# Altium schematic sheet MCU.SchDoc
size Legal; CompanyName: PloopyCo; Organization: Ploopy Co; Address1: 137-1140 Burnhamthorpe Road W; Address2: Mississauga; Address3: Ontario; Address4: Canada L5C 0A3; DocumentNumber: 3; Revision: R1.004; SheetNumber: 3; SheetTotal: 8
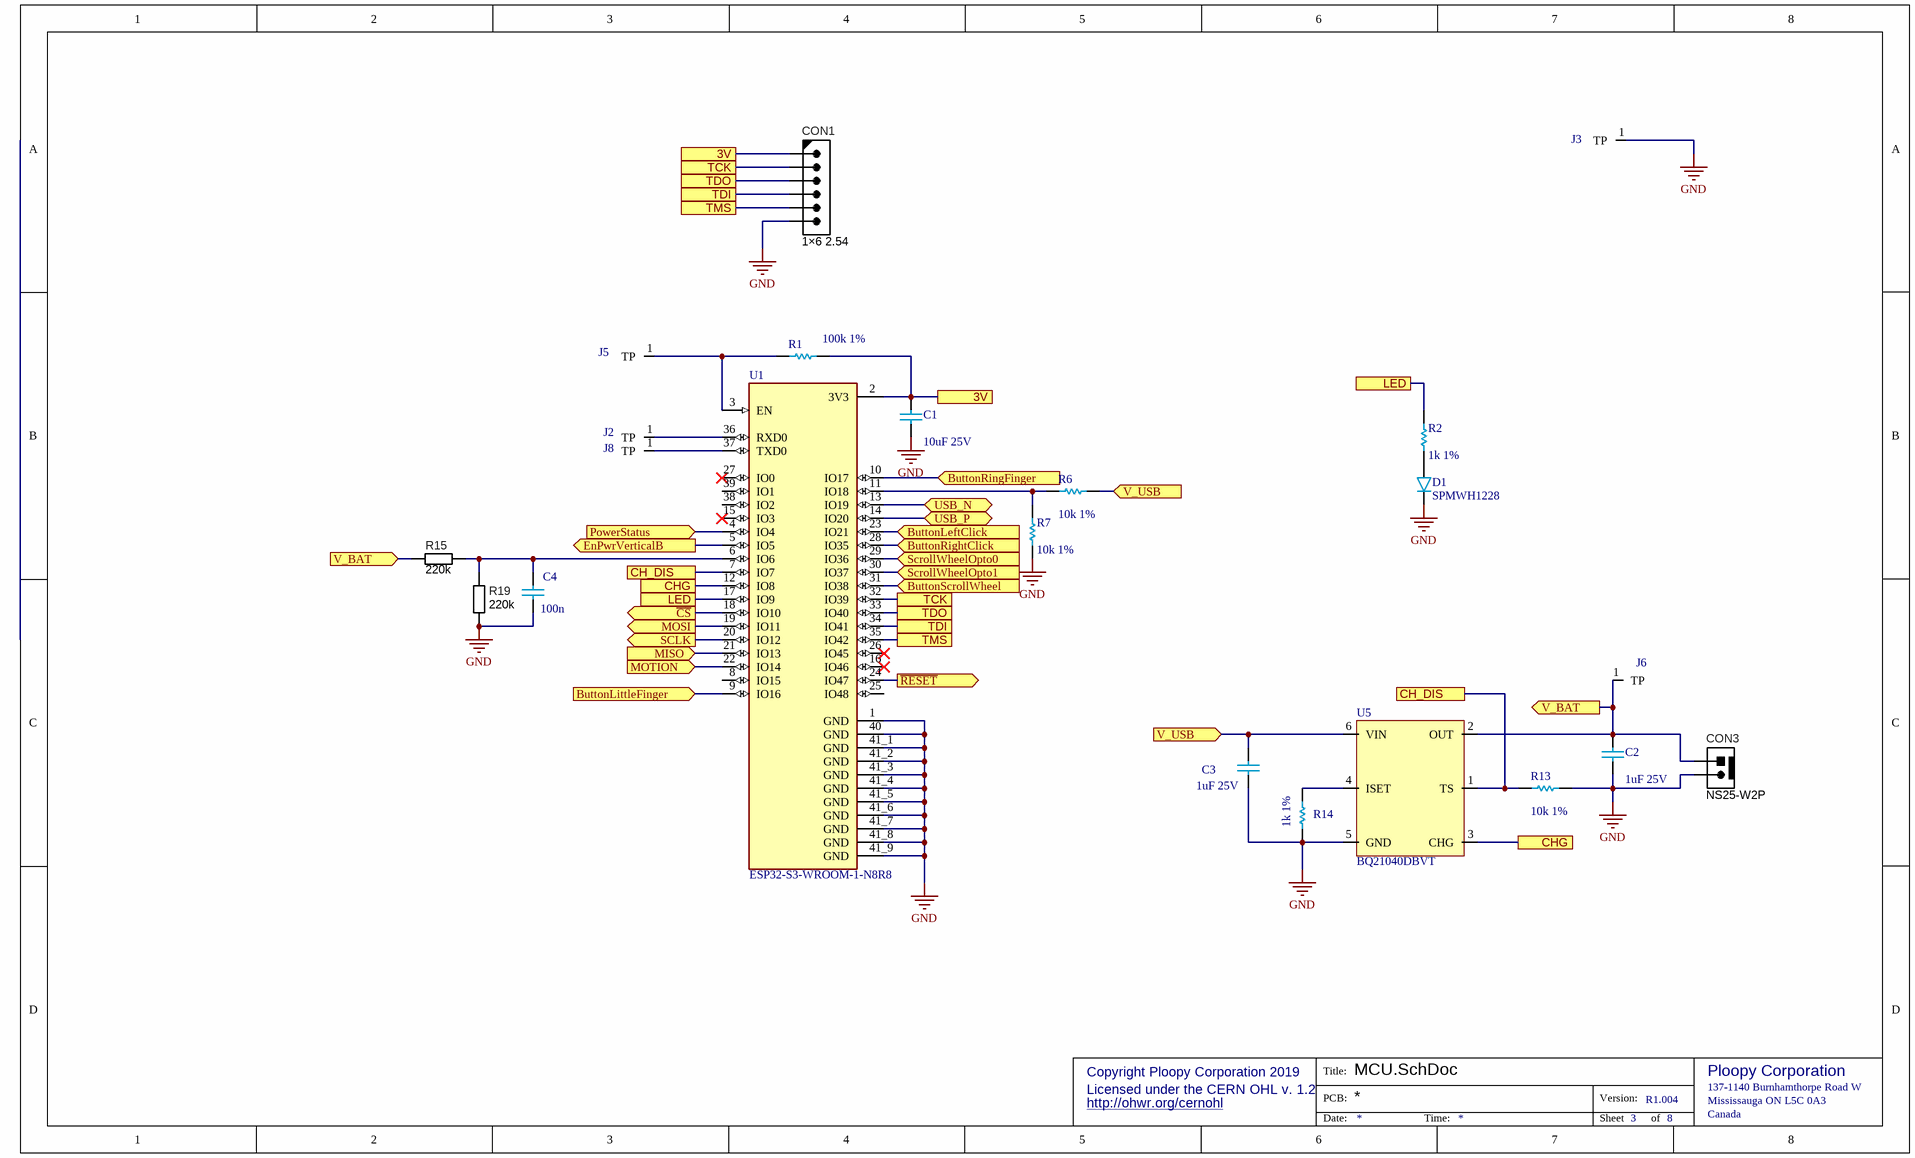
[diagram p0: MCU.SchDoc]

## Parts
C1  value 10uF 25V  [C0603]  (hidden comment: 0805)
C2  value 1uF 25V  [C0603]  (hidden comment: 0805)
C3  value 1uF 25V  [C0603]  (hidden comment: 0805)
C4  value 100n  [C0603]  (hidden comment: 0805)
CON1  1×6 2.54  [PH2.54_1X6]
CON3  NS25-W2P  [MOLEST_L2.54_2W]
D1  SPMWH1228  [SPMWH1228]
J2  TestPoint  [TestPoint]  (value not drawn)
J3  TestPoint  [TestPoint]  (value not drawn)
J5  TestPoint  [TestPoint]  (value not drawn)
J6  TestPoint  [TestPoint]  (value not drawn)
J8  TestPoint  [TestPoint]  (value not drawn)
R1  value 100k 1%  [R0603]  (hidden comment: 0805)
R2  value 1k 1%  [R0603]  (hidden comment: 0805)
R6  value 10k 1%  [R0603]  (hidden comment: 0805)
R7  value 10k 1%  [R0603]  (hidden comment: 0805)
R13  value 10k 1%  [R0603]  (hidden comment: 0805)
R14  value 1k 1%  [R0603]  (hidden comment: 0805)
R15  220k  [R0603]
R19  220k  [R0603]
U1  ESP32-S3-WROOM-1-N8R8  [XCVR_ESP32S3WROOM1N8R8]
U5  BQ21040DBVT  [PESD3V3S4UD - SOT95P275X110-6N]

## Ports
3V, ButtonLeftClick (in), ButtonLittleFinger (in), ButtonRightClick (in), ButtonRingFinger (in), ButtonScrollWheel (in), CH_DIS, CHG, EnPwrVerticalB (out), LED, MISO (in), MOSI (out), MOTION (in), PowerStatus (in), SCLK (out), ScrollWheelOpto0 (in), ScrollWheelOpto1 (in), TCK, TDI, TDO, TMS, USB_N (bidir), USB_P (bidir), V_BAT (in), V_BAT (out), V_USB (in), ~{CS} (out), ~{RESET} (out)

## Nets
GND: C1.1 C2.1 C3.1 C4.1 CON1.6 CON3.2 D1.2(C) J3.1(TP) R7.1 R13.1 R14.1 R19.1 U1.1(GND) U1.40(GND) U1.41_1(GND) U1.41_2(GND) U1.41_3(GND) U1.41_4(GND) U1.41_5(GND) U1.41_6(GND) U1.41_7(GND) U1.41_8(GND) U1.41_9(GND) U5.5(GND)
3V: C1.2 CON1.1 R1.2 U1.2(3V3) ; port 3V
ButtonLeftClick: U1.23(IO21) ; port ButtonLeftClick
ButtonLittleFinger: U1.9(IO16) ; port ButtonLittleFinger
ButtonRightClick: U1.28(IO35) ; port ButtonRightClick
ButtonRingFinger: U1.10(IO17) ; port ButtonRingFinger
ButtonScrollWheel: U1.31(IO38) ; port ButtonScrollWheel
~{CS}: U1.18(IO10) ; port ~{CS}
CH_DIS: R13.2 U1.7(IO7) U5.1(TS) ; port CH_DIS
CHG: U1.12(IO8) U5.3(CHG) ; port CHG
EnPwrVerticalB: U1.5(IO5) ; port EnPwrVerticalB
LED: R2.2 U1.17(IO9) ; port LED
MISO: U1.21(IO13) ; port MISO
MOSI: U1.19(IO11) ; port MOSI
MOTION: U1.22(IO14) ; port MOTION
PowerStatus: U1.4(IO4) ; port PowerStatus
~{RESET}: U1.24(IO47) ; port ~{RESET}
SCLK: U1.20(IO12) ; port SCLK
ScrollWheelOpto0: U1.29(IO36) ; port ScrollWheelOpto0
ScrollWheelOpto1: U1.30(IO37) ; port ScrollWheelOpto1
TCK: CON1.2 U1.32(IO39) ; port TCK
TDI: CON1.4 U1.34(IO41) ; port TDI
TDO: CON1.3 U1.33(IO40) ; port TDO
TMS: CON1.5 U1.35(IO42) ; port TMS
USB_N: U1.13(IO19) ; port USB_N
USB_P: U1.14(IO20) ; port USB_P
V_BAT: C2.2 CON3.1 J6.1(TP) R15.1 U5.2(OUT) ; port V_BAT
V_USB: C3.2 R6.2 U5.6(VIN) ; port V_USB
NetC4_2: C4.2 R15.2 R19.2 U1.6(IO6)
NetD1_1: D1.1(A) R2.1
NetJ2_1: J2.1(TP) U1.36(RXD0)
NetJ5_1: J5.1(TP) R1.1 U1.3(EN)
NetJ8_1: J8.1(TP) U1.37(TXD0)
NetR6_1: R6.1 R7.2 U1.11(IO18)
NetR14_2: R14.2 U5.4(ISET)

Not connected (* = marked no-connect by the designer): U1 8(IO15) 15(IO3)* 16(IO46)* 25(IO48) 26(IO45)* 27(IO0)* 38(IO2) 39(IO1)

## Notes on the sheet
- Copyright Ploopy Corporation 2019
- Licensed under the CERN OHL v. 1.2
- http://ohwr.org/cernohl
- Title:
- PCB:
- Version:
- Ploopy Corporation
- Mississauga ON L5C 0A3
- 137-1140 Burnhamthorpe Road W
- Date:
- Time:
- Sheet
- of
- Canada

## Library data of the parts
C1 = Cap 10uF 25V: 0805, X5R or better; PNP-Nzl: 2; PNP-dx: 0; PNP-X: 2.00; PNP-Y: 1.25; PNP-Lv: 1; PNP-TS: 70; PNP-Type: chi; PNP-FeedType: Tape; PNP-TapeWidth: 8; PNP-dy: 0; PNP-Pt: 0; PNP-W: 0; PNP-Thk: 1.25; PNP-Level: 1; PNP-Voff: 0; PNP-PlacePriority: 1; PNP-A: 0; PNP-TapeIndex: 1; Supplier 1: Mouser; Supplier Part Number 1: 81-GRM21BR61E106KA3L; Supplier 2: Digi-Key; Supplier Part Number 2: 490-5523-1-ND; PNP-da: 0
C2-C4 = Cap 1uF 25V: 0805, X5R or better; PNP-Nzl: 2; PNP-dx: 0; PNP-X: 2.00; PNP-Y: 1.25; PNP-Lv: 1; PNP-TS: 70; PNP-Type: chi; PNP-FeedType: Tape; PNP-TapeWidth: 8; Supplier 1: Digi-Key; Supplier Part Number 1: 1276-1066-2-ND; Supplier 2: Digi-Key; Supplier Part Number 2: 1276-1066-1-ND; PNP-dy: 0; PNP-Pt: 0; PNP-W: 0; PNP-Thk: 1.25; PNP-Level: 1; PNP-Voff: 0; PNP-PlacePriority: 1; PNP-A: 0; PNP-TapeIndex: 1; PNP-da: 0
CON1 = PH2.54_1X6: 1x3 standart 100mil pinheader
CON3 = MOLEST_L2.54_2W: Molex-like 2.54mm connector with lock
D1 = SPMWH1228: 3V/0.5W white LED, 2.8mm x 3.5mm; PNP-Nzl: 3; PNP-dx: 0; PNP-X: 2.8; PNP-Y: 3.2; PNP-A: 90; PNP-Thk: 0.65; PNP-Lv: 1; PNP-TS: 70; PNP-Type: chi; PNP-FeedType: Tape; PNP-TapeWidth: 8; PNP-PlacePriority: 2; PNP-da: 550; PNP-dy: 0; PNP-Pt: 0; PNP-W: 0; PNP-Level: 1; PNP-Voff: 0; PNP-TapeIndex: 1; Supplier 2: Digi-Key; Supplier Part Number 2: 1510-1428-1-ND; Supplier 3: Digi-Key; Supplier Part Number 3: 1510-1429-1-ND; Supplier 1: Arrow
R1 = Res 100k 1% 0805: Chip resistor; PNP-Nzl: 2; PNP-dx: 0; PNP-X: 2.00; PNP-Y: 1.25; PNP-Thk: 0.55; PNP-Lv: 1; PNP-TS: 70; PNP-Type: chi; PNP-FeedType: Tape; PNP-TapeWidth: 8; Supplier 1: Digi-Key; Supplier 2: Digi-Key; Supplier Part Number 1: RMCF0805FT100KTR-ND; Supplier Part Number 2: RMCF0805FT100KCT-ND; PNP-dy: 0; PNP-Pt: 0; PNP-W: 0; PNP-Level: 1; PNP-Voff: 0; PNP-PlacePriority: 1; PNP-A: 0; PNP-TapeIndex: 1; PNP-da: 0
R2 R14 = Res 1k 1% 0805: Chip resistor, 1/8W 100PPM; PNP-Nzl: 2; PNP-dx: 0; PNP-X: 2.00; PNP-Y: 1.25; PNP-Thk: 0.55; PNP-Lv: 1; PNP-TS: 70; PNP-Type: chi; PNP-FeedType: Tape; PNP-TapeWidth: 8; Supplier 1: Digi-Key; Supplier Part Number 1: RMCF0805FT1K00TR-ND; PNP-dy: 0; PNP-Pt: 0; PNP-W: 0; PNP-Level: 1; PNP-Voff: 0; PNP-PlacePriority: 1; PNP-A: 0; PNP-TapeIndex: 1; PNP-da: 0
R6 R7 R13 = Res 10k 1% 0805: Chip resistor; PNP-Nzl: 2; PNP-dx: 0; PNP-X: 2.00; PNP-Y: 1.25; PNP-Thk: 0.55; PNP-Lv: 1; PNP-TS: 70; PNP-Type: chi; PNP-FeedType: Tape; PNP-TapeWidth: 8; Supplier 1: Digi-Key; Supplier Part Number 1: RMCF0805FT10K0TR-ND; PNP-dy: 0; PNP-Pt: 0; PNP-W: 0; PNP-Level: 1; PNP-Voff: 0; PNP-PlacePriority: 1; PNP-A: 0; PNP-TapeIndex: 1; PNP-da: 0
R15 R19 = R0603: Generic 0603 resistor footprint
U1 = ESP32-S3-WROOM-1-N8R8: Bluetooth, WiFi 802.11b/g/n, Bluetooth v5.0 Transceiver Module 2.4GHz PCB Trace Surface Mount; MF: Espressif Systems; Package: None; Price: None; Check_prices: https://www.snapeda.com/parts/ESP32-S3-WROOM-1-N8R8/Espressif+Systems/view-part/?ref=eda; Value: *; SnapEDA_Link: https://www.snapeda.com/parts/ESP32-S3-WROOM-1-N8R8/Espressif+Systems/view-part/?ref=snap; MP: ESP32-S3-WROOM-1-N8R8; Availability: In Stock; Purchase-URL: https://pricing.snapeda.com/search?q=ESP32-S3-WROOM-1-N8R8&ref=eda